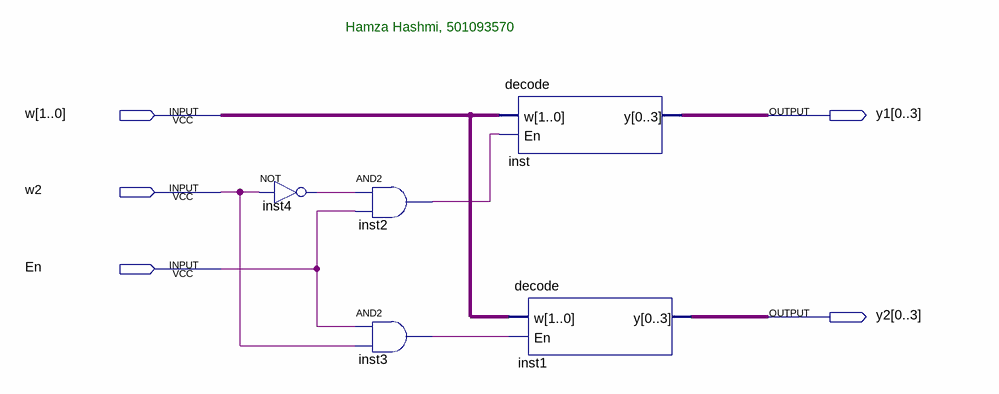
[diagram p0: schematic sheet]
// Quartus schematic decodModified_1.bdf as structural Verilog: 5 symbols, 5 pins
module decodModified_1 (
  input  [1:0] w,
  input  w2,
  input  En,
  output [0:3] y1,
  output [0:3] y2
);

  wire inst2_out, inst3_out, inst4_out;

  not inst4 (inst4_out, w2);
  and inst2 (inst2_out, inst4_out, En);
  and inst3 (inst3_out, En, w2);
  decode inst (.w(w), .En(inst2_out), .y(y1));
  decode inst1 (.w(w), .En(inst3_out), .y(y2));

  // Notes on the sheet:
  //   Hamza Hashmi, 501093570
endmodule
